# Altium schematic sheet MCU176_1.SchDoc
size A2
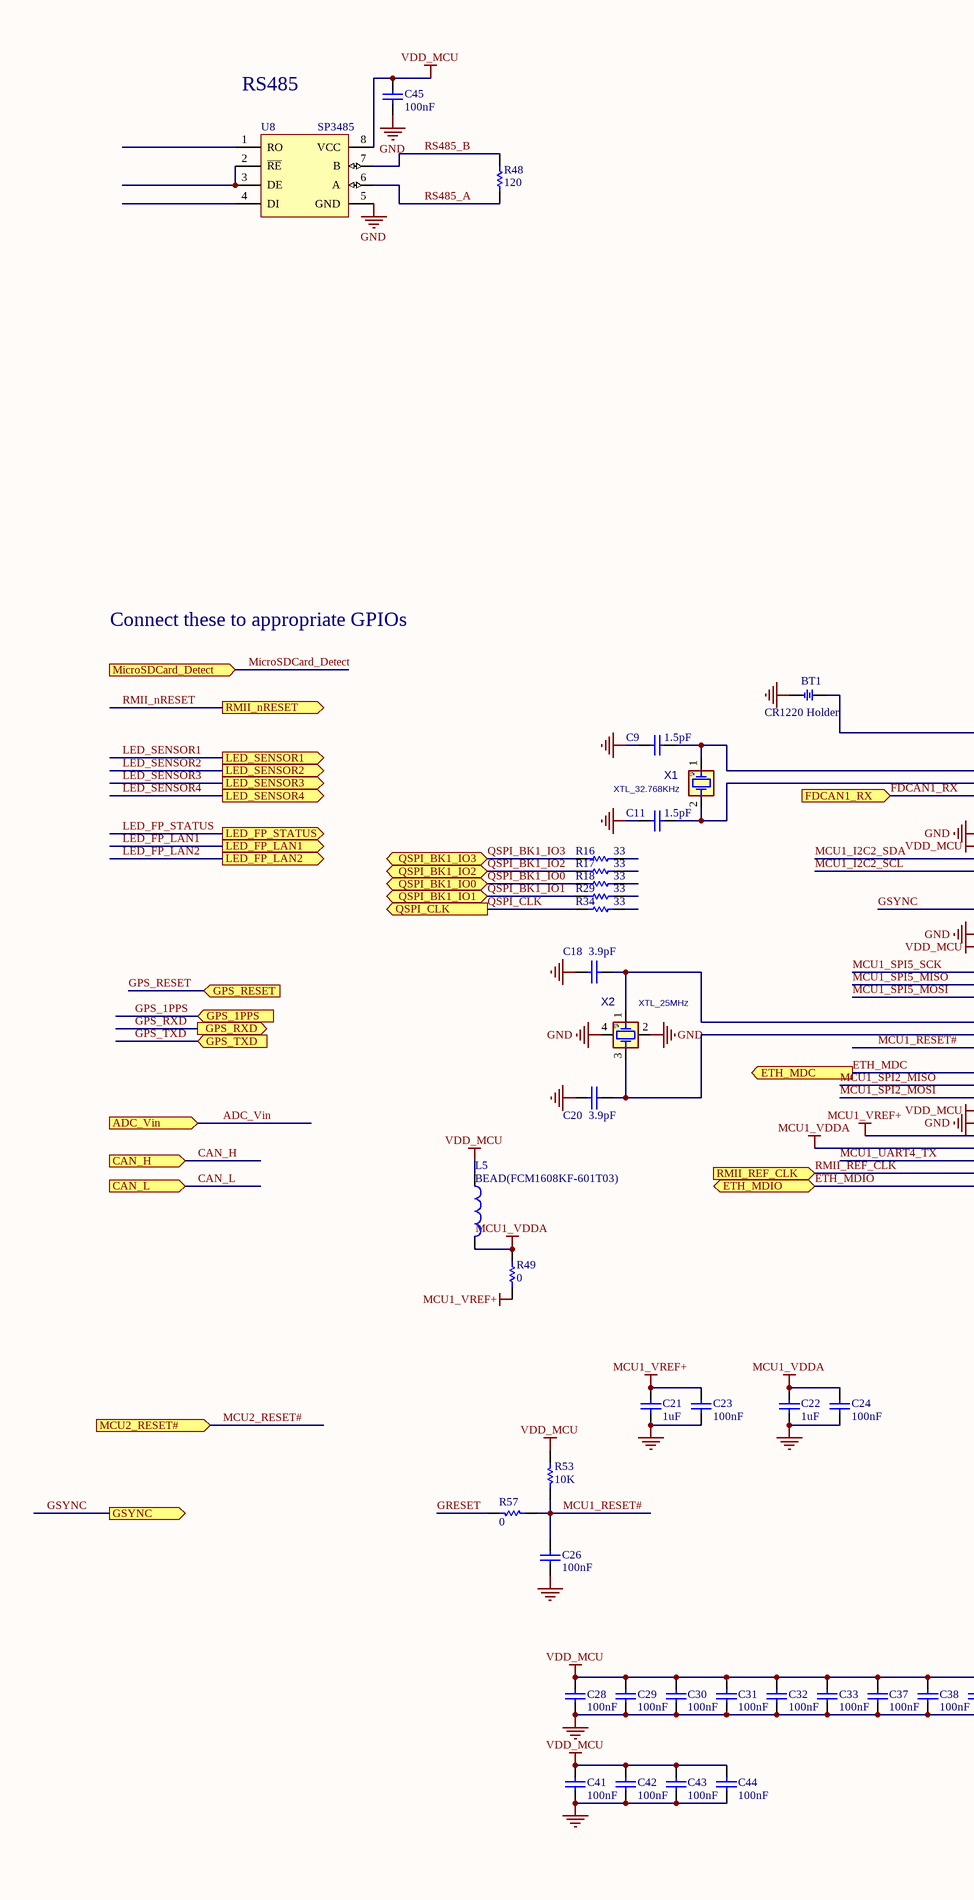
[diagram p0: MCU176_1.SchDoc, left]
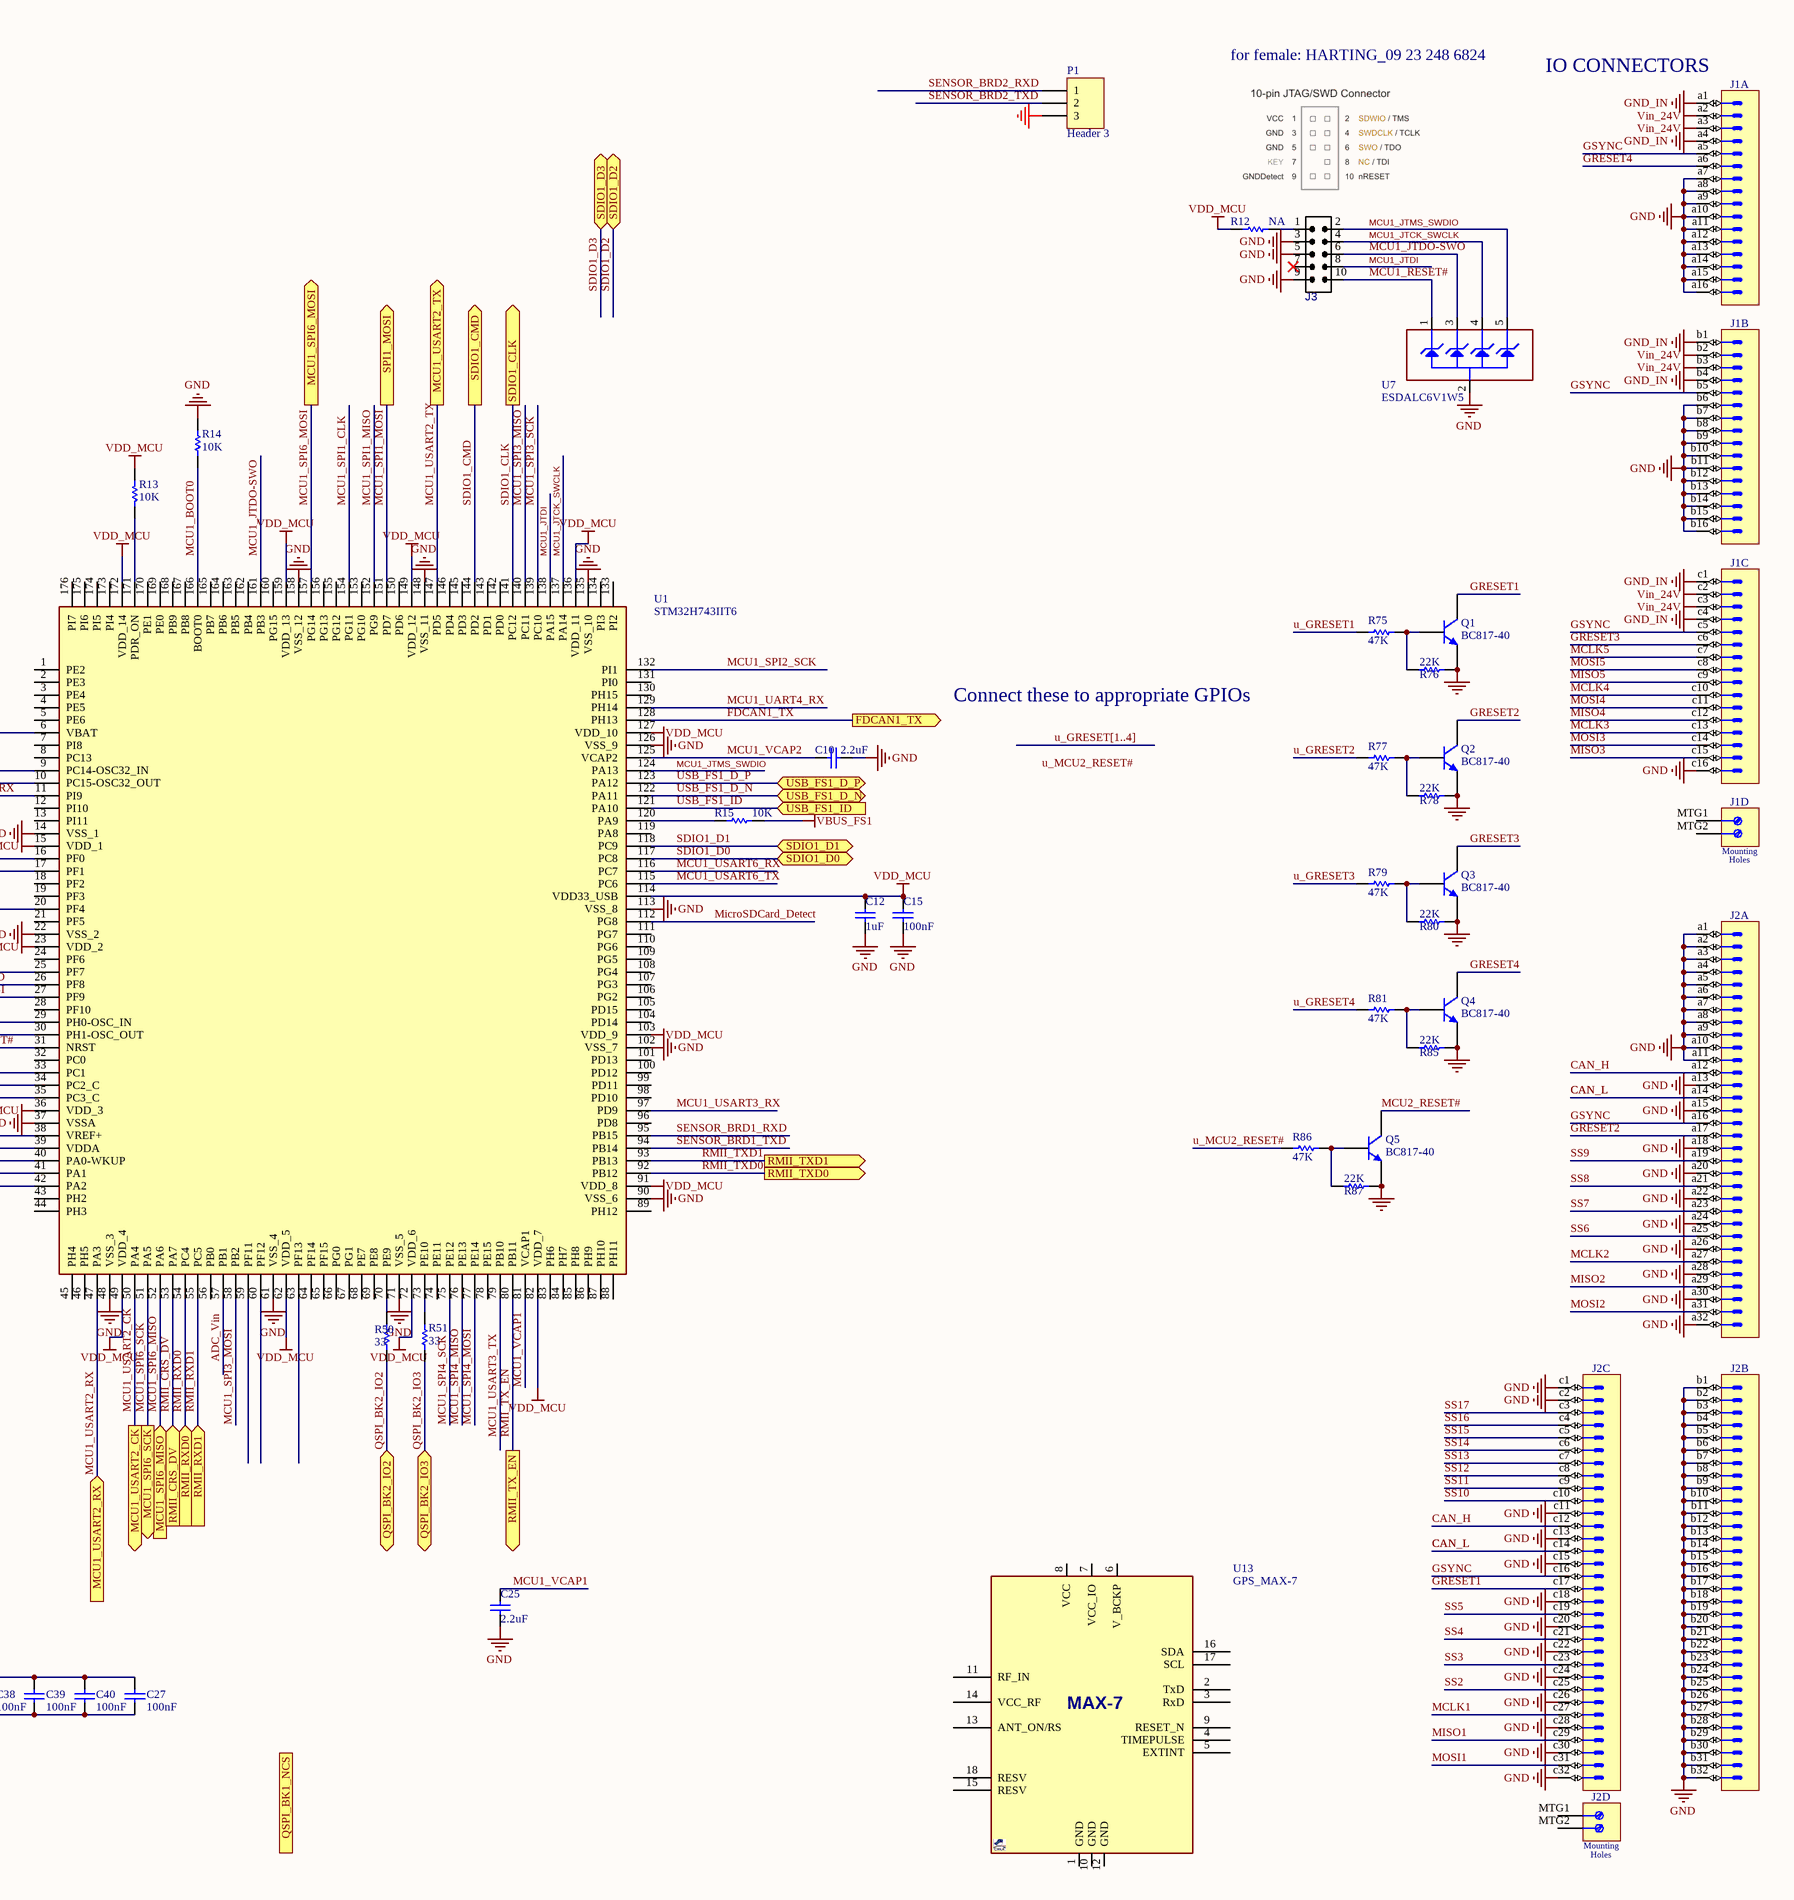
[diagram p1: MCU176_1.SchDoc, right]

## Parts
BT1  CR1220 Holder  [BTH1220]
C9  1.5pF  [C0603E]
C10  2.2uF  [C0603E]
C11  1.5pF  [C0603E]
C12  1uF  [C0603E]
C15  100nF  [C0603E]
C18  3.9pF  [C0603E]
C20  3.9pF  [C0603E]
C21  1uF  [C0603E]
C22  1uF  [C0603E]
C23  100nF  [C0603E]
C24  100nF  [C0603E]
C25  2.2uF  [C0603E]
C26  100nF  [C0603E]
C27  100nF  [C0603E]
C28  100nF  [C0603E]
C29  100nF  [C0603E]
C30  100nF  [C0603E]
C31  100nF  [C0603E]
C32  100nF  [C0603E]
C33  100nF  [C0603E]
C37  100nF  [C0603E]
C38  100nF  [C0603E]
C39  100nF  [C0603E]
C40  100nF  [C0603E]
C41  100nF  [C0603E]
C42  100nF  [C0603E]
C43  100nF  [C0603E]
C44  100nF  [C0603E]
C45  100nF  [C0603E]
J1  DIN 41612 Type 2C  [HARTING_09 23 148 6921]  (value not drawn)  (parts A,B,C,D of 4)
J2  DIN 41612 Type C  [HARTING_09 03 696 6921]  (value not drawn)  (parts A,B,C,D of 4)
J3  IDC_2X5  [IDC_2X5]  (value not drawn)
L5  BEAD(FCM1608KF-601T03)  [L0603E]
P1  Header 3  [xh-3]
Q1  BC817-40  [SOT-23-3]
Q2  BC817-40  [SOT-23-3]
Q3  BC817-40  [SOT-23-3]
Q4  BC817-40  [SOT-23-3]
Q5  BC817-40  [SOT-23-3]
R12  NA  [R0603E]
R13  10K  [R0603E]
R14  10K  [R0603E]
R15  10K  [R0603E]
R16  33  [R0603E]
R17  33  [R0603E]
R18  33  [R0603E]
R29  33  [R0603E]
R34  33  [R0603E]
R48  120  [R0603E]
R49  0  [R0603E]
R50  33  [R0603E]
R51  33  [R0603E]
R53  10K  [R0603E]
R57  0  [R0603E]
R75  47K  [R0603E]
R76  22K  [R0603E]
R77  47K  [R0603E]
R78  22K  [R0603E]
R79  47K  [R0603E]
R80  22K  [R0603E]
R81  47K  [R0603E]
R85  22K  [R0603E]
R86  47K  [R0603E]
R87  22K  [R0603E]
U1  STM32H743IIT6  [QFP50P2600X2600X160-176N]
U7  ESDALC6V1W5  [SOT65P210X110-5N]
U8  (no value)  [so8]
U13  GPS_MAX-7  [GPS_MAX]
X1  XTL_32.768KHz  [XTL_2_1610]
X2  XTL_25MHz  [XTL_4_2016]

## Ports
ADC_Vin (in), CAN_H (in), CAN_L (in), ETH_MDC (out), ETH_MDIO (bidir), FDCAN1_RX (in), FDCAN1_TX (out), GPS_1PPS (in), GPS_RESET (in), GPS_RXD (out), GPS_TXD (in), GSYNC (out), LED_FP_LAN1 (out), LED_FP_LAN2 (out), LED_FP_STATUS (out), LED_SENSOR1 (out), LED_SENSOR2 (out), LED_SENSOR3 (out), LED_SENSOR4 (out), MCU1_SPI6_MISO (in), MCU1_SPI6_MOSI (out), MCU1_SPI6_SCK (out), MCU1_USART2_CK (out), MCU1_USART2_RX (in), MCU1_USART2_TX (out), MCU2_RESET# (in), MicroSDCard_Detect (in), QSPI_BK1_IO0 (bidir), QSPI_BK1_IO1 (bidir), QSPI_BK1_IO2 (bidir), QSPI_BK1_IO3 (bidir), QSPI_BK1_NCS (out), QSPI_BK2_IO2 (bidir), QSPI_BK2_IO3 (bidir), QSPI_CLK (out), RMII_CRS_DV (in), RMII_nRESET (out), RMII_REF_CLK (in), RMII_RXD0 (in), RMII_RXD1 (in), RMII_TX_EN (out), RMII_TXD0 (out), RMII_TXD1 (out), SDIO1_CLK (out), SDIO1_CMD (out), SDIO1_D0 (bidir), SDIO1_D1 (bidir), SDIO1_D2 (bidir), SDIO1_D3 (bidir), SPI1_MOSI (out), USB_FS1_D_N (bidir), USB_FS1_D_P (bidir), USB_FS1_ID (in)

## Nets
GND: BT1.2 C9.2 C10.2 C11.2 C12.1 C15.1 C18.2 C20.2 C21.1 C22.1 C23.1 C24.1 C25.1 C26.1 C27.2 C28.2 C29.2 C30.2 C31.2 C32.2 C33.2 C37.2 C38.2 C39.2 C40.2 C41.2 C42.2 C43.2 C44.2 C45.1 J1.a7 J1.a8 J1.a9 J1.a10 J1.a11 J1.a12 J1.a13 J1.a14 J1.a15 J1.a16 J1.b6 J1.b7 J1.b8 J1.b9 J1.b10 J1.b11 J1.b12 J1.b13 J1.b14 J1.b15 J1.b16 J1.c16 J2.a1 J2.a2 J2.a3 J2.a4 J2.a5 J2.a6 J2.a7 J2.a8 J2.a9 J2.a10 J2.a11 J2.a13 J2.a15 J2.a18 J2.a20 J2.a22 J2.a24 J2.a26 J2.a28 J2.a30 J2.a32 J2.b1 J2.b2 J2.b3 J2.b4 J2.b5 J2.b6 J2.b7 J2.b8 J2.b9 J2.b10 J2.b11 J2.b12 J2.b13 J2.b14 J2.b15 J2.b16 J2.b17 J2.b18 J2.b19 J2.b20 J2.b21 J2.b22 J2.b23 J2.b24 J2.b25 J2.b26 J2.b27 J2.b28 J2.b29 J2.b30 J2.b31 J2.b32 J2.c1 J2.c2 J2.c11 J2.c13 J2.c15 J2.c18 J2.c20 J2.c22 J2.c24 J2.c26 J2.c28 J2.c30 J2.c32 J3.3 J3.5 J3.9 P1.3 Q1.2(E) Q2.2(E) Q3.2(E) Q4.2(E) Q5.2(E) R14.2 R76.1 R78.1 R80.1 R85.1 R87.1 U1.14(VSS_1) U1.22(VSS_2) U1.37(VSSA) U1.48(VSS_3) U1.61(VSS_4) U1.71(VSS_5) U1.90(VSS_6) U1.102(VSS_7) U1.113(VSS_8) U1.126(VSS_9) U1.135(VSS_10) U1.148(VSS_11) U1.158(VSS_12) U7.2(GND) U8.5(GND) X2.2(GND1) X2.4(GND2)
GND_IN: J1.a1 J1.a4 J1.b1 J1.b4 J1.c1 J1.c4
MCU1_VDDA: C22.2 C24.2 L5.2 R49.1 U1.39(VDDA)
MCU1_VREF+: C21.2 C23.2 R49.2 U1.38(VREF+)
VBUS_FS1: R15.1
VDD_MCU: C12.2 C15.2 C27.1 C28.1 C29.1 C30.1 C31.1 C32.1 C33.1 C37.1 C38.1 C39.1 C40.1 C41.1 C42.1 C43.1 C44.1 C45.2 L5.1 R12.2 R13.1 R53.1 U1.15(VDD_1) U1.23(VDD_2) U1.36(VDD_3) U1.49(VDD_4) U1.62(VDD_5) U1.72(VDD_6) U1.82(VDD_7) U1.91(VDD_8) U1.103(VDD_9) U1.114(VDD33_USB) U1.127(VDD_10) U1.136(VDD_11) U1.149(VDD_12) U1.159(VDD_13) U1.172(VDD_14) U8.8(VCC)
Vin_24V: J1.a2 J1.a3 J1.b2 J1.b3 J1.c2 J1.c3
ADC_Vin: U1.57(PB1) ; port ADC_Vin
CAN_H: J2.a12 J2.c12 ; port CAN_H
CAN_L: J2.a14 J2.c14 ; port CAN_L
ETH_MDC: U1.33(PC1) ; port ETH_MDC
ETH_MDIO: U1.42(PA2) ; port ETH_MDIO
FDCAN1_RX: U1.11(PI9) ; port FDCAN1_RX
FDCAN1_TX: U1.128(PH13) ; port FDCAN1_TX
GPS_1PPS: port GPS_1PPS
GPS_RESET: port GPS_RESET
GPS_RXD: port GPS_RXD
GPS_TXD: port GPS_TXD
GRESET: R57.1
GRESET1: J2.c17 Q1.3(C)
GRESET2: J2.a17 Q2.3(C)
GRESET3: J1.c6 Q3.3(C)
GRESET4: J1.a6 Q4.3(C)
GSYNC: J1.a5 J1.b5 J1.c5 J2.a16 J2.c16 U1.20(PF4) ; port GSYNC
LED_FP_LAN1: port LED_FP_LAN1
LED_FP_LAN2: port LED_FP_LAN2
LED_FP_STATUS: port LED_FP_STATUS
LED_SENSOR1: port LED_SENSOR1
LED_SENSOR2: port LED_SENSOR2
LED_SENSOR3: port LED_SENSOR3
LED_SENSOR4: port LED_SENSOR4
MCLK1: J2.c27
MCLK2: J2.a27
MCLK3: J1.c13
MCLK4: J1.c10
MCLK5: J1.c7
MCU1_BOOT0: R14.1 U1.166(BOOT0)
MCU1_I2C2_SCL: U1.17(PF1)
MCU1_I2C2_SDA: U1.16(PF0)
MCU1_JTCK_SWCLK: J3.4 U1.137(PA14) U7.4(IO3)
MCU1_JTDI: J3.8 U1.138(PA15)
MCU1_JTDO-SWO: J3.6 U1.161(PB3) U7.3(IO2)
MCU1_JTMS_SWDIO: J3.2 U1.124(PA13) U7.5(IO4)
MCU1_RESET#: C26.2 J3.10 R53.2 R57.2 U1.31(NRST) U7.1(IO1)
MCU1_SPI1_CLK: U1.154(PG11)
MCU1_SPI1_MISO: U1.152(PG9)
MCU1_SPI1_MOSI: U1.151(PD7) ; port SPI1_MOSI
MCU1_SPI2_MISO: U1.34(PC2_C)
MCU1_SPI2_MOSI: U1.35(PC3_C)
MCU1_SPI2_SCK: U1.132(PI1)
MCU1_SPI3_MISO: U1.140(PC11)
MCU1_SPI3_MOSI: U1.58(PB2)
MCU1_SPI3_SCK: U1.139(PC10)
MCU1_SPI4_MISO: U1.76(PE13)
MCU1_SPI4_MOSI: U1.77(PE14)
MCU1_SPI4_SCK: U1.75(PE12)
MCU1_SPI5_MISO: U1.26(PF8)
MCU1_SPI5_MOSI: U1.27(PF9)
MCU1_SPI5_SCK: U1.25(PF7)
MCU1_SPI6_MISO: U1.52(PA6) ; port MCU1_SPI6_MISO
MCU1_SPI6_MOSI: U1.157(PG14) ; port MCU1_SPI6_MOSI
MCU1_SPI6_SCK: U1.51(PA5) ; port MCU1_SPI6_SCK
MCU1_UART4_RX: U1.129(PH14)
MCU1_UART4_TX: U1.40(PA0-WKUP)
MCU1_USART2_CK: U1.50(PA4) ; port MCU1_USART2_CK
MCU1_USART2_RX: U1.47(PA3) ; port MCU1_USART2_RX
MCU1_USART2_TX: U1.147(PD5) ; port MCU1_USART2_TX
MCU1_USART3_RX: U1.97(PD9)
MCU1_USART3_TX: U1.79(PB10)
MCU1_USART6_RX: U1.116(PC7)
MCU1_USART6_TX: U1.115(PC6)
MCU1_VCAP1: C25.2 U1.81(VCAP1)
MCU1_VCAP2: C10.1 U1.125(VCAP2)
MCU2_RESET#: Q5.3(C) ; port MCU2_RESET#
MicroSDCard_Detect: U1.112(PG8) ; port MicroSDCard_Detect
MISO1: J2.c29
MISO2: J2.a29
MISO3: J1.c15
MISO4: J1.c12
MISO5: J1.c9
MOSI1: J2.c31
MOSI2: J2.a31
MOSI3: J1.c14
MOSI4: J1.c11
MOSI5: J1.c8
QSPI_BK1_IO0: R18.2 ; port QSPI_BK1_IO0
QSPI_BK1_IO1: R29.2 ; port QSPI_BK1_IO1
QSPI_BK1_IO2: R17.2 ; port QSPI_BK1_IO2
QSPI_BK1_IO3: R16.2 ; port QSPI_BK1_IO3
QSPI_BK2_IO2: R50.2 ; port QSPI_BK2_IO2
QSPI_BK2_IO3: R51.2 ; port QSPI_BK2_IO3
QSPI_CLK: R34.2 ; port QSPI_CLK
RMII_CRS_DV: U1.53(PA7) ; port RMII_CRS_DV
RMII_nRESET: port RMII_nRESET
RMII_REF_CLK: U1.41(PA1) ; port RMII_REF_CLK
RMII_RXD0: U1.54(PC4) ; port RMII_RXD0
RMII_RXD1: U1.55(PC5) ; port RMII_RXD1
RMII_TX_EN: U1.80(PB11) ; port RMII_TX_EN
RMII_TXD0: U1.92(PB12) ; port RMII_TXD0
RMII_TXD1: U1.93(PB13) ; port RMII_TXD1
RS485_A: R48.2 U8.6(A)
RS485_B: R48.1 U8.7(B)
SDIO1_CLK: U1.141(PC12) ; port SDIO1_CLK
SDIO1_CMD: U1.144(PD2) ; port SDIO1_CMD
SDIO1_D0: U1.117(PC8) ; port SDIO1_D0
SDIO1_D1: U1.118(PC9) ; port SDIO1_D1
SDIO1_D2: port SDIO1_D2
SDIO1_D3: port SDIO1_D3
SENSOR_BRD1_RXD: U1.95(PB15)
SENSOR_BRD1_TXD: U1.94(PB14)
SENSOR_BRD2_RXD: P1.1
SENSOR_BRD2_TXD: P1.2
SS2: J2.c25
SS3: J2.c23
SS4: J2.c21
SS5: J2.c19
SS6: J2.a25
SS7: J2.a23
SS8: J2.a21
SS9: J2.a19
SS10: J2.c10
SS11: J2.c9
SS12: J2.c8
SS13: J2.c7
SS14: J2.c6
SS15: J2.c5
SS16: J2.c4
SS17: J2.c3
u_GRESET1: R75.1
u_GRESET2: R77.1
u_GRESET3: R79.1
u_GRESET4: R81.1
u_MCU2_RESET#: R86.1
USB_FS1_D_N: U1.122(PA11) ; port USB_FS1_D_N
USB_FS1_D_P: U1.123(PA12) ; port USB_FS1_D_P
USB_FS1_ID: U1.121(PA10) ; port USB_FS1_ID
NetBT1_1: BT1.1 U1.6(VBAT)
NetC9_1: C9.1 U1.9(PC14-OSC32_IN) X1.1(OSC1)
NetC11_1: C11.1 U1.10(PC15-OSC32_OUT) X1.2(OSC2)
NetC18_1: C18.1 U1.29(PH0-OSC_IN) X2.1(XA)
NetC20_1: C20.1 U1.30(PH1-OSC_OUT) X2.3(XB)
NetJ3_1: J3.1 R12.1
NetQ1_1: Q1.1(B) R75.2 R76.2
NetQ2_1: Q2.1(B) R77.2 R78.2
NetQ3_1: Q3.1(B) R79.2 R80.2
NetQ4_1: Q4.1(B) R81.2 R85.2
NetQ5_1: Q5.1(B) R86.2 R87.2
NetR13_2: R13.2 U1.171(PDR_ON)
NetR15_2: R15.2 U1.120(PA9)
NetR50_1: R50.1 U1.70(PE9)
NetR51_1: R51.1 U1.73(PE10)
NetU8_2: U8.2(~{RE}) U8.3(DE)

Not connected (* = marked no-connect by the designer): J1 MTG1 MTG2; J2 MTG1 MTG2; J3 7*; R16 1; R17 1; R18 1; R29 1; R34 1; U1 1(PE2) 2(PE3) 3(PE4) 4(PE5) 5(PE6) 7(PI8) 8(PC13) 12(PI10) 13(PI11) 18(PF2) 19(PF3) 21(PF5) 24(PF6) 28(PF10) 32(PC0) 43(PH2) 44(PH3) 45(PH4) 46(PH5) 56(PB0) 59(PF11) 60(PF12) 63(PF13) 64(PF14) 65(PF15) 66(PG0) 67(PG1) 68(PE7) 69(PE8) 74(PE11) 78(PE15) 83(PH6) 84(PH7) 85(PH8) 86(PH9) 87(PH10) 88(PH11) 89(PH12) 96(PD8) 98(PD10) 99(PD11) 100(PD12) 101(PD13) 104(PD14) 105(PD15) 106(PG2) 107(PG3) 108(PG4) 109(PG5) 110(PG6) 111(PG7) 119(PA8) 130(PH15) 131(PI0) 133(PI2) 134(PI3) 142(PD0) 143(PD1) 145(PD3) 146(PD4) 150(PD6) 153(PG10) 155(PG12) 156(PG13) 160(PG15) 162(PB4) 163(PB5) 164(PB6) 165(PB7) 167(PB8) 168(PB9) 169(PE0) 170(PE1) 173(PI4) 174(PI5) 175(PI6) 176(PI7); U8 1(RO) 4(DI); U13 1(GND) 2(TxD) 3(RxD) 4(TIMEPULSE) 5(EXTINT) 6(V_BCKP) 7(VCC_IO) 8(VCC) 9(RESET_N) 10(GND) 11(RF_IN) 12(GND) 13(ANT_ON/RS) 14(VCC_RF) 15(RESV) 16(SDA) 17(SCL) 18(RESV)

## Buses and harness runs
bus u_GRESET[1..4]

## Notes on the sheet
- RS485
- for female: HARTING_09 23 248 6824
- IO CONNECTORS
- Connect these to appropriate GPIOs
- Labels drawn without touching a wire or pin: u_MCU2_RESET#
- (in symbol GPS_MAX-7Q) MAX-7
- (in symbol HARTING_09 03 696 6921, part D) Mounting; Holes
- (in symbol HARTING_09 23 148 6921, part D) Mounting; Holes

## Library data of the parts
BT1 = BATH_CR1220: BATTERY HOLDER, CR1220; VALUE: BAT3volt; MANF_P#: -; .: http://www.chila.ir
C9 C11 = Capacitor_ST: Capacitor 0402 / 0603 / 0805; Value: 100nF; Revision: July-2002: Re-released for DXP Platform.
C10 C12 C15 C21-C25 C45 = Cap: Capacitor; Value: 10nF; Published: 8-Jun-2000; Revision: July-2002: Re-released for DXP Platform.; Publisher: Altium Limited
C18 C20 C27-C33 C37-C44 = CAP: Capacitor
  C27-C33 C37-C44: Published: 8-Jun-2000; Revision: July-2002: Re-released for DXP Platform.; Publisher: Altium Limited; Value: 100nF
C26 = CAP: Capacitor; Value: 100pF; Published: 8-Jun-2000; Revision: July-2002: Re-released for DXP Platform.; Publisher: Altium Limited
J1 = HARTING_09 23 148 6921: Connector 48abc Male (3x16); Part Description: DIN 41612, Type 2C, Thru-Hole;  Rows a+b+c, 48 Position, Performance level 2, Lead 3.0mm, Pitch 2.54mm, Right Angle Male Connector; PressFit: No; Part Number: HARTING_09 23 148 6921; Component Kind: Standard; Component Type: Standard; Pin Count: 48; Family: DIN 41612 Type 2C; Mounted: Yes; Socket: No; SMD: No; Sense: No; Status: None; Manufacturer: HARTING; Manufacturer Part Number: 09 23 148 6921; ComponentHeight: 11mm; HelpURL: \\cern.ch\dfs\Applications\Altium\Datasheets\HARTING_09 23 148 6921.pdf; Author: CERN DEM JLC; CreateDate: 9/4/2012; LatestRevisionDate: 9/4/2012
J2 = HARTING_09 03 696 6921: Connector 96abc male (3x32); Part Description: DIN 41612, Type C, Thru-Hole;  Rows a+b+c, 96 Position, Performance level 2, Lead 3.0 mm, Pitch 2.54mm, Right Angle Male Connector With Coding; PressFit: No; Part Number: HARTING_09 03 696 6921; Component Kind: Standard; Component Type: Standard; Pin Count: 98; Family: DIN 41612 Type C; Mounted: Yes; Socket: No; SMD: No; Sense: No; Status: None; Manufacturer: HARTING; Manufacturer Part Number: 09 03 696 6921; ComponentHeight: 13.1mm; HelpURL: \\cern.ch\dfs\Applications\Altium\Datasheets\HARTING_09 03 696 6921.pdf; Author: CERN DEM JLC; CreateDate: 3/30/2011; LatestRevisionDate: 3/30/2011
J3 = IDC_2X5: CONN, IDC, Male, pitch: 2.54mm, 10POS; VALUE: IDC_2X5
L5 = Inductor: Value: 100uH; Published: 8-Jun-2000; Revision: July-2002: Re-released for DXP Platform.; Publisher: Altium Limited
P1 = Header 3: Header, 3-Pin; LatestRevisionDate: 17-Jul-2002; LatestRevisionNote: Re-released for DXP Platform.; Publisher: Altium Limited
Q1-Q5 = BC817-40: TRANS NPN 300V 0.3A SOT23; Manufacturer: Micro Commercial Co; Manufacturer Part Number: MMBTA42-TP; Current Footprint: TO-236-3, SC-59, SOT-23-3; PCB Name: GS-101; Board Qty: 1000; ITEM/NO: 71; Vce Saturation (Max) @ Ib, Ic: 500mV @ 2mA, 20mA; DC Current Gain (hFE) (Min) @ Ic, Vce: 40 @ 30mA, 10V; Frequency - Transition: 50MHz; Current - Collector Cutoff (Max): 100nA (ICBO); HelpURL: D:\HNA\Datasheet Documents\MMBTA42(SOT-23).pdf; Part Number: BC817-40; Size / Dimension: NULL; Supplier: Digi-Key; Mounting Type: Surface Mount; Base Part Number: MMBTA42; Supplier Device Package: SOT-23; Part Status: Active; RoHS: RoHS Compliant; Category: Discrete Semiconductor Products; Supplier Part Number: MMBTA42TPMSCT-ND; Operating Temperature: -55°C ~ 150°C (TJ); Package / Case: TO-236-3, SC-59, SOT-23-3; Transistor Type: NPN; Packaging: Cut Tape (CT); Pricing: 1=0.22, 10=0.203, 25=0.146, 100=0.1136, 250=0.07136, 500=0.06084, 1000=0.04137 (USD); Stock: 49544
R12 R13 R15-R18 R29 R34 R48-R51 R53 R57 = Res1: Resistor; Value: 1K; Published: 8-Jun-2000; Revision: July-2002: Re-released for DXP Platform.; Publisher: Altium Limited
R14 R75-R81 R85-R87 = res1: Resistor; Value: 1K; Published: 8-Jun-2000; Revision: July-2002: Re-released for DXP Platform.; Publisher: Altium Limited
U1 = STM32H743IIT6: Integrated Circuit; Manufacturer_Name: STMicroelectronics; Datasheet Link: https://componentsearchengine.com/Datasheets/1/STM32H743IIT6.pdf; Height: 1.6mm; Manufacturer_Part_Number: STM32H743IIT6; Mouser Part Number: 511-STM32H743IIT6; Mouser Price/Stock: https://www.mouser.co.uk/ProductDetail/STMicroelectronics/STM32H743IIT6?qs=FNcb6ahWXRzE163cq8Rfjg%3D%3D; Arrow Part Number: STM32H743IIT6; Arrow Price/Stock: https://www.arrow.com/en/products/stm32h743iit6/stmicroelectronics?region=nac
U7 = ESDALC6V1W5: Dual Transil array for ESD protection; Manuf_1: STM; Manuf_Part_1: ESDA5V3L; Ref St: 9179034; Provided: ST; ECCN_US/EU: EAR99/NEC; Distrib: ST; Order: ESDA5V3L; Ordered by: STM
U8 = SP3485: IC TXRX RS485 HALF DUPLEX 8SOIC; Manufacturer: Exar Corporation; Manufacturer Part Number: SP3485CN-L; Current Footprint: 8-SOIC (0.154", 3.90mm Width); Board Qty: 100; PCB Name: Main_PCB; Mounting Type: Surface Mount; Package / Case: 8-SOIC (0.154", 3.90mm Width); ComponentLink1URL: http://www.exar.com/Common/Content/Document.ashx?id=639; ComponentLink1Description: http://www.exar.com/Common/Content/Document.ashx?id=639; Part Number: SP3485; Pricing: 1=2.24, 10=2.027, 100=1.6292, 250=1.4482, 500=1.26716, 1000=0.937 (USD); Size / Dimension: NULL; Supplier: Digi-Key; Supplier Part Number: 1016-1144-5-ND; HelpURL: D:\HNA\Datasheet Documents\SP3485_100_061912.pdf
U13 = GPS_MAX-7Q: GPS Module, UART/I2C, GPS/QZSS, GLONASS; MANF: U-BLOX; MANF_P#: MAX-7Q; PARAM2: 2.7~3.6V, Lowest power; VALUE: GPS_MAX-7
X1 = XTL_2_32.768_3215A: Crystal; MANF_P#: ABS05-32.768KHZ-9-T; PARAM2: 7pF, 20PPM; PARAM: -40~85oC; MANF: -; PRICE: 1$; VALUE: XTL_32.768KHz
X2 = XTL_4_25MHz_3225: CRYSTAL; PARAM: 10PPM; DESC: DESCRIPTION; DIST#: MOUSER; PARAM2: PARAM; MANF_P#: XRCGB25M000F1H00R0; MANF: -; ASSEMBLY: ASSEMBLY; PRICE: 0.5$; VALUE: XTL_25MHz